# Altium schematic sheet Sheet1.SchDoc
size A4
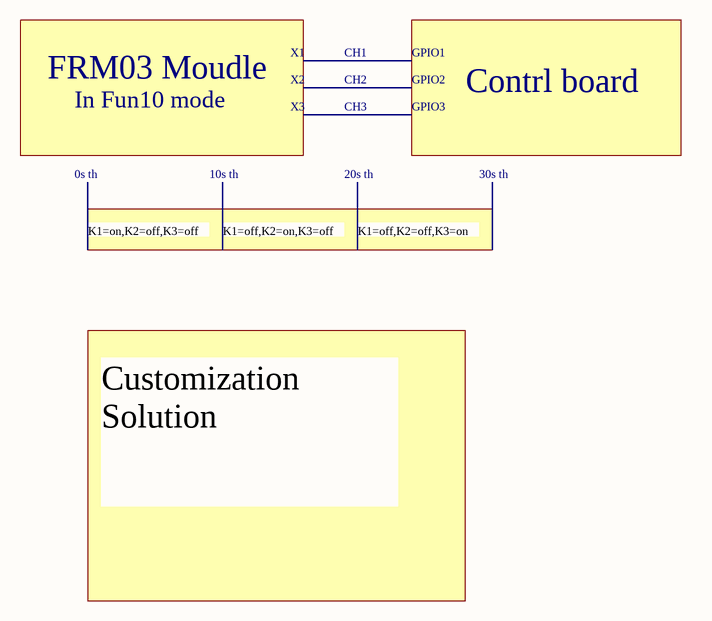
[diagram p0: Sheet1.SchDoc]

## Notes on the sheet
- X1
- CH1
- GPIO1
- FRM03 Moudle
- In Fun10 mode
- X2
- X3
- CH2
- CH3
- GPIO2
- GPIO3
- Contrl board
- 0s th
- 10s th
- 20s th
- 30s th
- K1=on,K2=off,K3=off
- K1=off,K2=on,K3=off
- K1=off,K2=off,K3=on
- Customization Solution